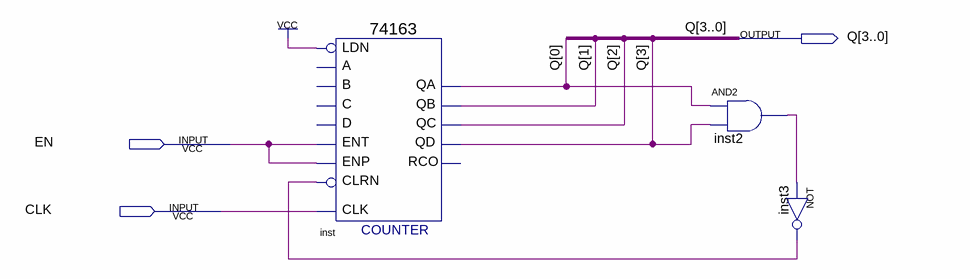
[diagram p0: schematic sheet]
// Quartus schematic SpecialCount0_9.bdf as structural Verilog: 3 symbols, 3 pins
module SpecialCount0_9 (
  input  EN,
  input  CLK,
  output [3:0] Q
);

  wire inst2_out, inst3_out;

  \74163  inst (
    .ENT(EN), .CLRN(inst3_out), .CLK(CLK), .ENP(EN), .LDN(1'b1), .QA(Q[0]), .QB(Q[1]), .QC(Q[2]), .QD(Q[3]));  // open: C, B, A, D, RCO
  and inst2 (inst2_out, Q[0], Q[3]);
  not inst3 (inst3_out, inst2_out);
endmodule
